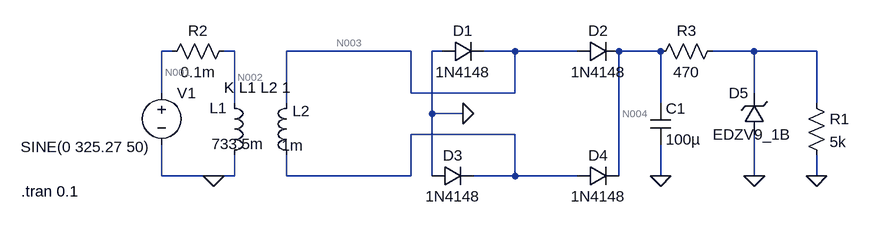
[diagram p0: schematic The_Full_Wave_rect.asc]
The_Full_Wave_rect.asc, the LTspice schematic file:
Version 4.1
SHEET 1 1076 680
WIRE 16 48 0 48
WIRE 112 48 96 48
WIRE 384 48 192 48
WIRE 432 48 416 48
WIRE 544 48 496 48
WIRE 640 48 544 48
WIRE 768 48 704 48
WIRE 912 48 848 48
WIRE 1008 48 912 48
WIRE 0 112 0 48
WIRE 384 112 384 48
WIRE 544 112 544 48
WIRE 544 112 384 112
WIRE 912 112 912 48
WIRE 112 128 112 48
WIRE 192 128 192 48
WIRE 768 128 768 48
WIRE 1008 128 1008 48
WIRE 416 144 416 48
WIRE 464 144 416 144
WIRE 544 176 384 176
WIRE 0 240 0 192
WIRE 80 240 0 240
WIRE 112 240 112 208
WIRE 112 240 80 240
WIRE 192 240 192 208
WIRE 384 240 384 176
WIRE 384 240 192 240
WIRE 416 240 416 144
WIRE 544 240 544 176
WIRE 544 240 480 240
WIRE 640 240 544 240
WIRE 704 240 704 48
WIRE 768 240 768 192
WIRE 912 240 912 176
WIRE 1008 240 1008 208
FLAG 80 240 0
FLAG 464 144 0
FLAG 1008 240 0
FLAG 768 240 0
FLAG 912 240 0
SYMBOL ind 96 112 R0
WINDOW 0 -22 23 Left 2
WINDOW 3 -19 79 Left 2
SYMATTR InstName L1
SYMATTR Value 733.5m
SYMATTR Type ind
SYMBOL ind 208 224 R180
WINDOW 0 -20 84 Left 2
WINDOW 3 -10 31 Left 2
SYMATTR InstName L2
SYMATTR Value 1m
SYMATTR Type ind
SYMBOL voltage 0 96 R0
WINDOW 3 -217 99 Left 2
WINDOW 123 0 0 Left 0
WINDOW 39 0 0 Left 0
SYMATTR InstName V1
SYMATTR Value SINE(0 325.27 50)
SYMBOL res 112 32 R90
WINDOW 0 0 56 VBottom 2
WINDOW 3 32 56 VTop 2
SYMATTR InstName R2
SYMATTR Value 0.1m
SYMBOL diode 432 64 R270
WINDOW 0 32 32 VTop 2
WINDOW 3 0 32 VBottom 2
SYMATTR InstName D1
SYMATTR Value 1N4148
SYMBOL diode 640 64 R270
WINDOW 0 32 32 VTop 2
WINDOW 3 0 32 VBottom 2
SYMATTR InstName D2
SYMATTR Value 1N4148
SYMBOL diode 416 256 R270
WINDOW 0 32 32 VTop 2
WINDOW 3 0 32 VBottom 2
SYMATTR InstName D3
SYMATTR Value 1N4148
SYMBOL diode 640 256 R270
WINDOW 0 32 32 VTop 2
WINDOW 3 0 32 VBottom 2
SYMATTR InstName D4
SYMATTR Value 1N4148
SYMBOL res 992 112 R0
SYMATTR InstName R1
SYMATTR Value 5k
SYMBOL cap 752 128 R0
SYMATTR InstName C1
SYMATTR Value 100µ
SYMBOL res 864 32 R90
WINDOW 0 0 56 VBottom 2
WINDOW 3 32 56 VTop 2
SYMATTR InstName R3
SYMATTR Value 470
SYMBOL zener 928 176 R180
WINDOW 0 24 64 Left 2
WINDOW 3 -40 0 Left 2
SYMATTR InstName D5
SYMATTR Value EDZV9_1B
TEXT 96 104 Left 2 !K L1 L2 1
TEXT -216 264 Left 2 !.tran 0.1

The netlist it stands for:
* The_Full_Wave_rect.asc
L1 N002 0 733.5m
L2 N006 N003 1m
V1 N001 0 SINE(0 325.27 50)
R2 N002 N001 0.1m
D1 0 N003 1N4148
D2 N003 N004 1N4148
D3 0 N006 1N4148
D4 N006 N004 1N4148
R1 N005 0 5k
C1 N004 0 100µ
R3 N005 N004 470
D5 0 N005 EDZV9_1B
.model D D
.lib standard.dio
K L1 L2 1
.tran 0.1
.backanno
.end

* Results of the author's LTspice run, read from the files saved beside the schematic
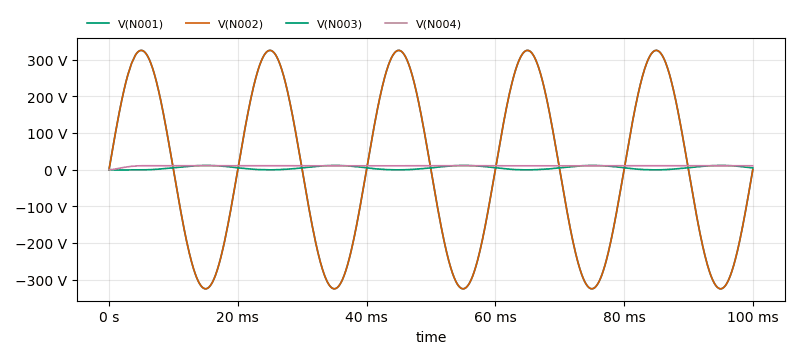
[diagram p1: Transient Analysis of The_Full_Wave_rect.asc, plotted from the saved traces]
* Transient Analysis, 1 run:
*   V(N001): min -325.3 V, max 325.3 V, average -10 mV, rms 230 V, last 0 V
*   V(N002): min -325.3 V, max 325.3 V, average -10.14 mV, rms 230 V, last 0 V
*   V(N003): min -1.054 V, max 11.27 V, average 4.935 V, rms 6.579 V, last 4.576 V
*   V(N004): min 0 V, max 10.57 V, average 10.21 V, rms 10.29 V, last 10.43 V